# Altium schematic sheet Part05_DDR2.SchDoc
size A4
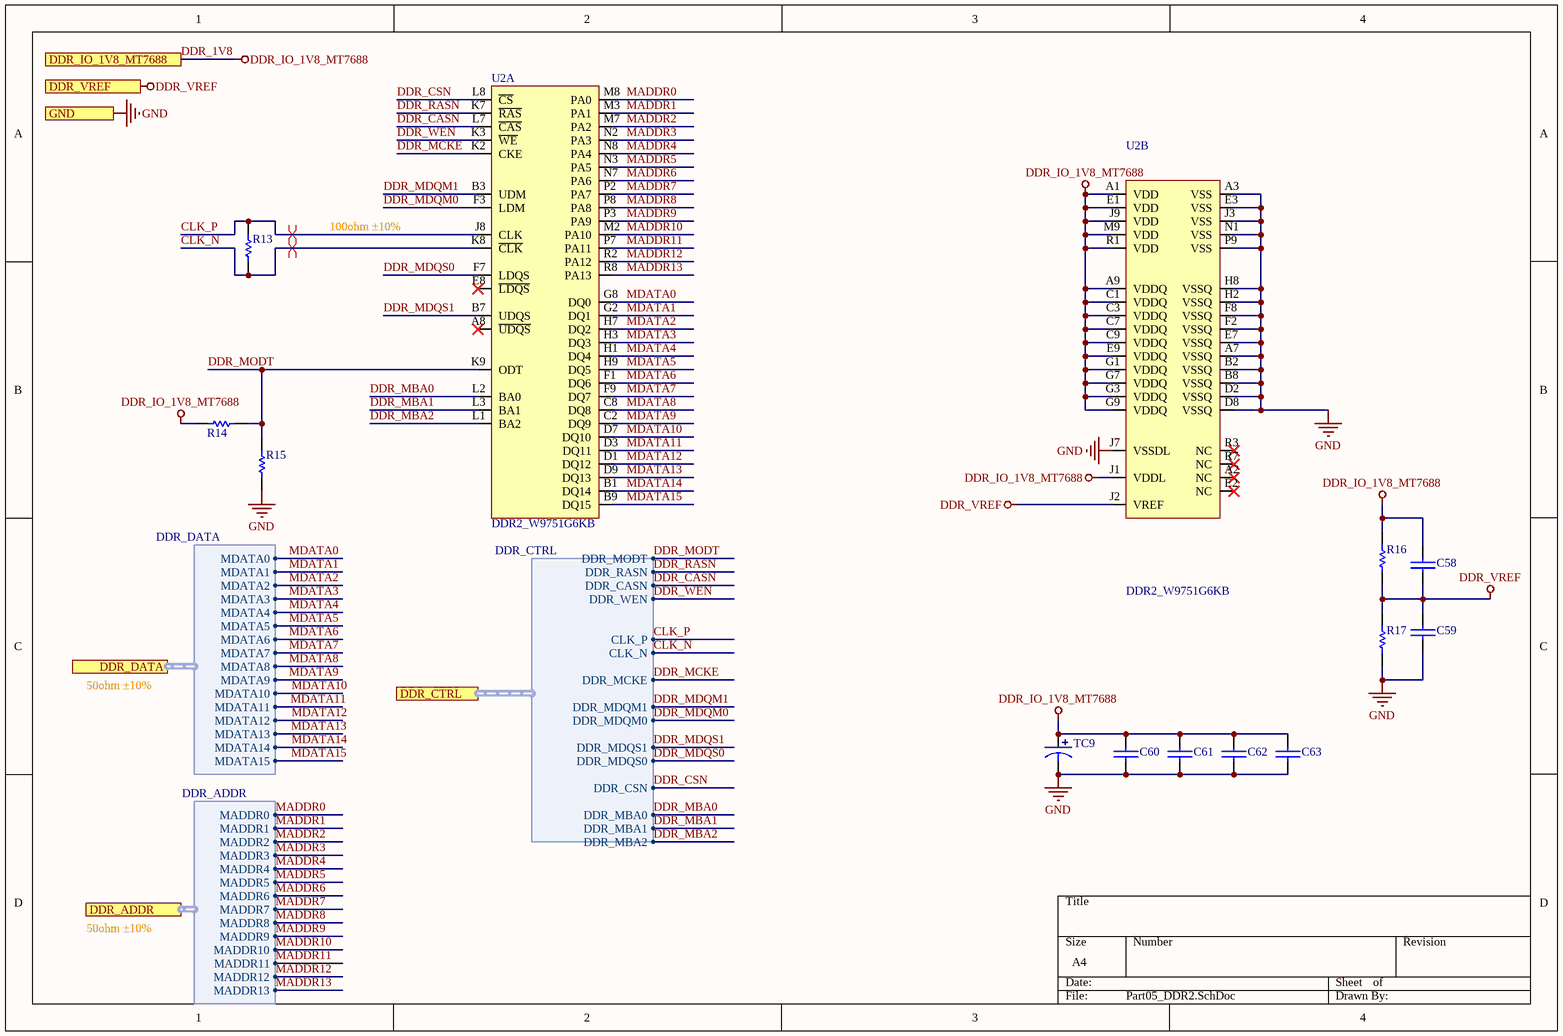
[diagram p0: Part05_DDR2.SchDoc]

## Parts
C58  0.1uF/16V  [0402C]  (value not drawn)
C59  0.1uF/16V  [0402C]  (value not drawn)
C60  0.1uF/16V  [0402C]  (value not drawn)
C61  0.1uF/16V  [0402C]  (value not drawn)
C62  0.1uF/16V  [0402C]  (value not drawn)
C63  0.1uF/16V  [0402C]  (value not drawn)
R13  RES  [0402R]  (value not drawn)
R14  RES  [0402R]  (value not drawn)
R15  RES  [0402R]  (value not drawn)
R16  RES  [0402R]  (value not drawn)
R17  RES  [0402R]  (value not drawn)
TC9  4.7uF/6.3V  [TAJ-A/3216]  (value not drawn)
U2  DDR2_W9751G6KB  [MICT-RT-84]  (parts A,B of 2)

## Ports
DDR_ADDR (harness DDR_ADDR), DDR_CTRL (harness DDR_CTRL), DDR_DATA (harness DDR_DATA), DDR_IO_1V8_MT7688, DDR_VREF, GND

## Harnesses
DDR_DATA: MDATA0, MDATA1, MDATA2, MDATA3, MDATA4, MDATA5, MDATA6, MDATA7, MDATA8, MDATA9, MDATA10, MDATA11, MDATA12, MDATA13, MDATA14, MDATA15
DDR_ADDR: MADDR0, MADDR1, MADDR2, MADDR3, MADDR4, MADDR5, MADDR6, MADDR7, MADDR8, MADDR9, MADDR10, MADDR11, MADDR12, MADDR13
DDR_CTRL: DDR_MODT, DDR_RASN, DDR_CASN, DDR_WEN, CLK_P, CLK_N, DDR_MCKE, DDR_MDQM1, DDR_MDQM0, DDR_MDQS1, DDR_MDQS0, DDR_CSN, DDR_MBA0, DDR_MBA1, DDR_MBA2

## Nets
DDR_1V8: C58.1 C60.1 C61.1 C62.1 C63.1 R14.1 R16.1 TC9.1 U2.A1(VDD) U2.A9(VDDQ) U2.C1(VDDQ) U2.C3(VDDQ) U2.C7(VDDQ) U2.C9(VDDQ) U2.E1(VDD) U2.E9(VDDQ) U2.G1(VDDQ) U2.G3(VDDQ) U2.G7(VDDQ) U2.G9(VDDQ) U2.J1(VDDL) U2.J9(VDD) U2.M9(VDD) U2.R1(VDD) ; port DDR_IO_1V8_MT7688  [also labelled DDR_IO_1V8_MT7688]
DDR_VREF: C58.2 C59.1 R16.2 R17.1 U2.J2(VREF) ; port DDR_VREF
GND: C59.2 C60.2 C61.2 C62.2 C63.2 R15.2 R17.2 TC9.2 U2.A3(VSS) U2.A7(VSSQ) U2.B2(VSSQ) U2.B8(VSSQ) U2.D2(VSSQ) U2.D8(VSSQ) U2.E3(VSS) U2.E7(VSSQ) U2.F2(VSSQ) U2.F8(VSSQ) U2.H2(VSSQ) U2.H8(VSSQ) U2.J3(VSS) U2.J7(VSSDL) U2.N1(VSS) U2.P9(VSS) ; port GND
CLK_N: R13.2 U2.K8(~{CLK}) ; port DDR_CTRL.CLK_N
CLK_P: R13.1 U2.J8(CLK) ; port DDR_CTRL.CLK_P
DDR_CASN: U2.L7(~{CAS}) ; port DDR_CTRL.DDR_CASN
DDR_CSN: U2.L8(~{CS}) ; port DDR_CTRL.DDR_CSN
DDR_MBA0: U2.L2(BA0) ; port DDR_CTRL.DDR_MBA0
DDR_MBA1: U2.L3(BA1) ; port DDR_CTRL.DDR_MBA1
DDR_MBA2: U2.L1(BA2) ; port DDR_CTRL.DDR_MBA2
DDR_MCKE: U2.K2(CKE) ; port DDR_CTRL.DDR_MCKE
DDR_MDQM0: U2.F3(LDM) ; port DDR_CTRL.DDR_MDQM0
DDR_MDQM1: U2.B3(UDM) ; port DDR_CTRL.DDR_MDQM1
DDR_MDQS0: U2.F7(LDQS) ; port DDR_CTRL.DDR_MDQS0
DDR_MDQS1: U2.B7(UDQS) ; port DDR_CTRL.DDR_MDQS1
DDR_MODT: R14.2 R15.1 U2.K9(ODT) ; port DDR_CTRL.DDR_MODT
DDR_RASN: U2.K7(~{RAS}) ; port DDR_CTRL.DDR_RASN
DDR_WEN: U2.K3(~{WE}) ; port DDR_CTRL.DDR_WEN
MADDR0: U2.M8(PA0) ; port DDR_ADDR.MADDR0
MADDR1: U2.M3(PA1) ; port DDR_ADDR.MADDR1
MADDR2: U2.M7(PA2) ; port DDR_ADDR.MADDR2
MADDR3: U2.N2(PA3) ; port DDR_ADDR.MADDR3
MADDR4: U2.N8(PA4) ; port DDR_ADDR.MADDR4
MADDR5: U2.N3(PA5) ; port DDR_ADDR.MADDR5
MADDR6: U2.N7(PA6) ; port DDR_ADDR.MADDR6
MADDR7: U2.P2(PA7) ; port DDR_ADDR.MADDR7
MADDR8: U2.P8(PA8) ; port DDR_ADDR.MADDR8
MADDR9: U2.P3(PA9) ; port DDR_ADDR.MADDR9
MADDR10: U2.M2(PA10) ; port DDR_ADDR.MADDR10
MADDR11: U2.P7(PA11) ; port DDR_ADDR.MADDR11
MADDR12: U2.R2(PA12) ; port DDR_ADDR.MADDR12
MADDR13: U2.R8(PA13) ; port DDR_ADDR.MADDR13
MDATA0: U2.G8(DQ0) ; port DDR_DATA.MDATA0
MDATA1: U2.G2(DQ1) ; port DDR_DATA.MDATA1
MDATA2: U2.H7(DQ2) ; port DDR_DATA.MDATA2
MDATA3: U2.H3(DQ3) ; port DDR_DATA.MDATA3
MDATA4: U2.H1(DQ4) ; port DDR_DATA.MDATA4
MDATA5: U2.H9(DQ5) ; port DDR_DATA.MDATA5
MDATA6: U2.F1(DQ6) ; port DDR_DATA.MDATA6
MDATA7: U2.F9(DQ7) ; port DDR_DATA.MDATA7
MDATA8: U2.C8(DQ8) ; port DDR_DATA.MDATA8
MDATA9: U2.C2(DQ9) ; port DDR_DATA.MDATA9
MDATA10: U2.D7(DQ10) ; port DDR_DATA.MDATA10
MDATA11: U2.D3(DQ11) ; port DDR_DATA.MDATA11
MDATA12: U2.D1(DQ12) ; port DDR_DATA.MDATA12
MDATA13: U2.D9(DQ13) ; port DDR_DATA.MDATA13
MDATA14: U2.B1(DQ14) ; port DDR_DATA.MDATA14
MDATA15: U2.B9(DQ15) ; port DDR_DATA.MDATA15

Not connected (* = marked no-connect by the designer): U2 A2(NC)* A8(~{UDQS})* E2(NC)* E8(~{LDQS})* R3(NC)* R7(NC)*

## Layout directives
differential pair: CLK_N, CLK_P

## Notes on the sheet
- 100ohm ±10%
- 50ohm ±10%

## Library data of the parts
C58-C63 = CAP: 无极性电容
TC9 = TCAP: 钽电容